# Altium schematic sheet Main.SchDoc: Main Circuit
size A; SheetNumber: 1; SheetTotal: 4
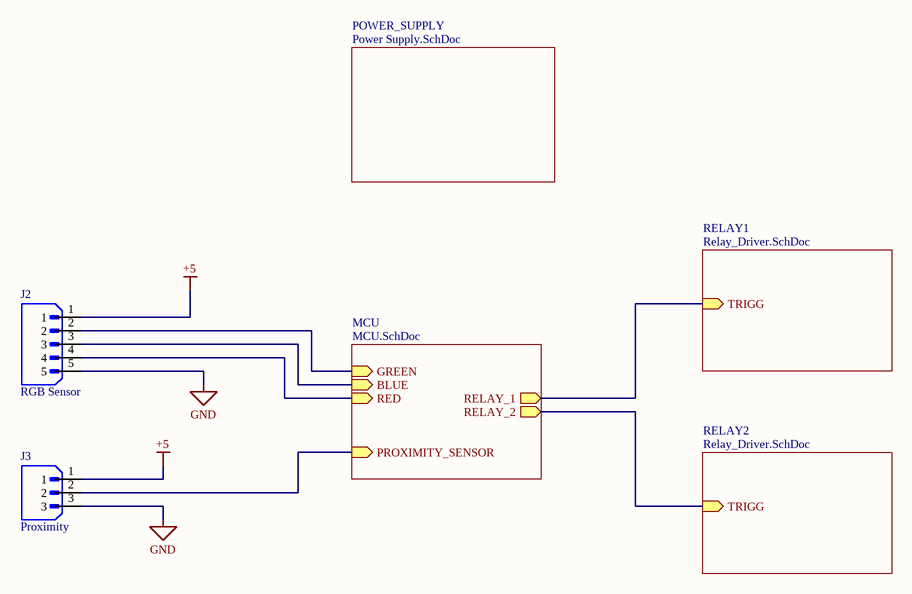
[diagram p0: Main.SchDoc]

## Parts
J2  RGB Sensor  [JST_B5B-XH-A(LF)(SN)]
J3  Proximity  [JST_B3B-XH-A (LF)(SN)]

## Sub-sheets
MCU = MCU.SchDoc: GREEN (in), RELAY_1 (out), BLUE (in), RELAY_2 (out), PROXIMITY_SENSOR (in), RED (in)
POWER_SUPPLY = Power Supply.SchDoc: no entries
RELAY1 = Relay_Driver.SchDoc: TRIGG (in)
RELAY2 = Relay_Driver.SchDoc: TRIGG (in)

## Nets
+5: J2.1 J3.1
GND: J2.5 J3.3
NetJ2_2: J2.2 ; sheet MCU/GREEN
NetJ2_3: J2.3 ; sheet MCU/BLUE
NetJ2_4: J2.4 ; sheet MCU/RED
NetJ3_2: J3.2 ; sheet MCU/PROXIMITY_SENSOR
(unnamed): sheet MCU/RELAY_1, sheet RELAY1/TRIGG
(unnamed): sheet MCU/RELAY_2, sheet RELAY2/TRIGG

## Library data of the parts
J2 = B5B-XH-A(LF)(SN): Connector Header Through Hole 5 position 0.098 (2.50mm); MF: JST Sales America Inc.; SnapEDA_Link: https://www.snapeda.com/parts/B5B-XH-A(LF)(SN)/JST+Sales+America+Inc./view-part/?ref=snap; Package: None; Value: *; MP: B5B-XH-A(LF)(SN); Check_prices: https://www.snapeda.com/parts/B5B-XH-A(LF)(SN)/JST+Sales+America+Inc./view-part/?ref=eda
J3 = B3B-XH-A_(LF)(SN): Connector Header Through Hole 3 position 0.098 (2.50mm); MF: JST Sales America Inc.; MP: B3B-XH-A (LF)(SN); SnapEDA_Link: https://www.snapeda.com/parts/B3B-XH-A%20(LF)(SN)/JST+Sales+America+Inc./view-part/?ref=snap; Package: None; Value: *; Check_prices: https://www.snapeda.com/parts/B3B-XH-A%20(LF)(SN)/JST+Sales+America+Inc./view-part/?ref=eda